# EasyEDA Pro project ProPrj_信达杯COREqwq_2025-12-12.epro

# Schematic Schematic1
Board Name: Board1; Create Date: 2025-10-07; Page Name: P1; Project Name: 信达杯COREqwq; Schematic Name: Schematic1; Update Date: 2025-10-07; Company: 嘉立创EDA; Page Size: A4; Version: V1.0
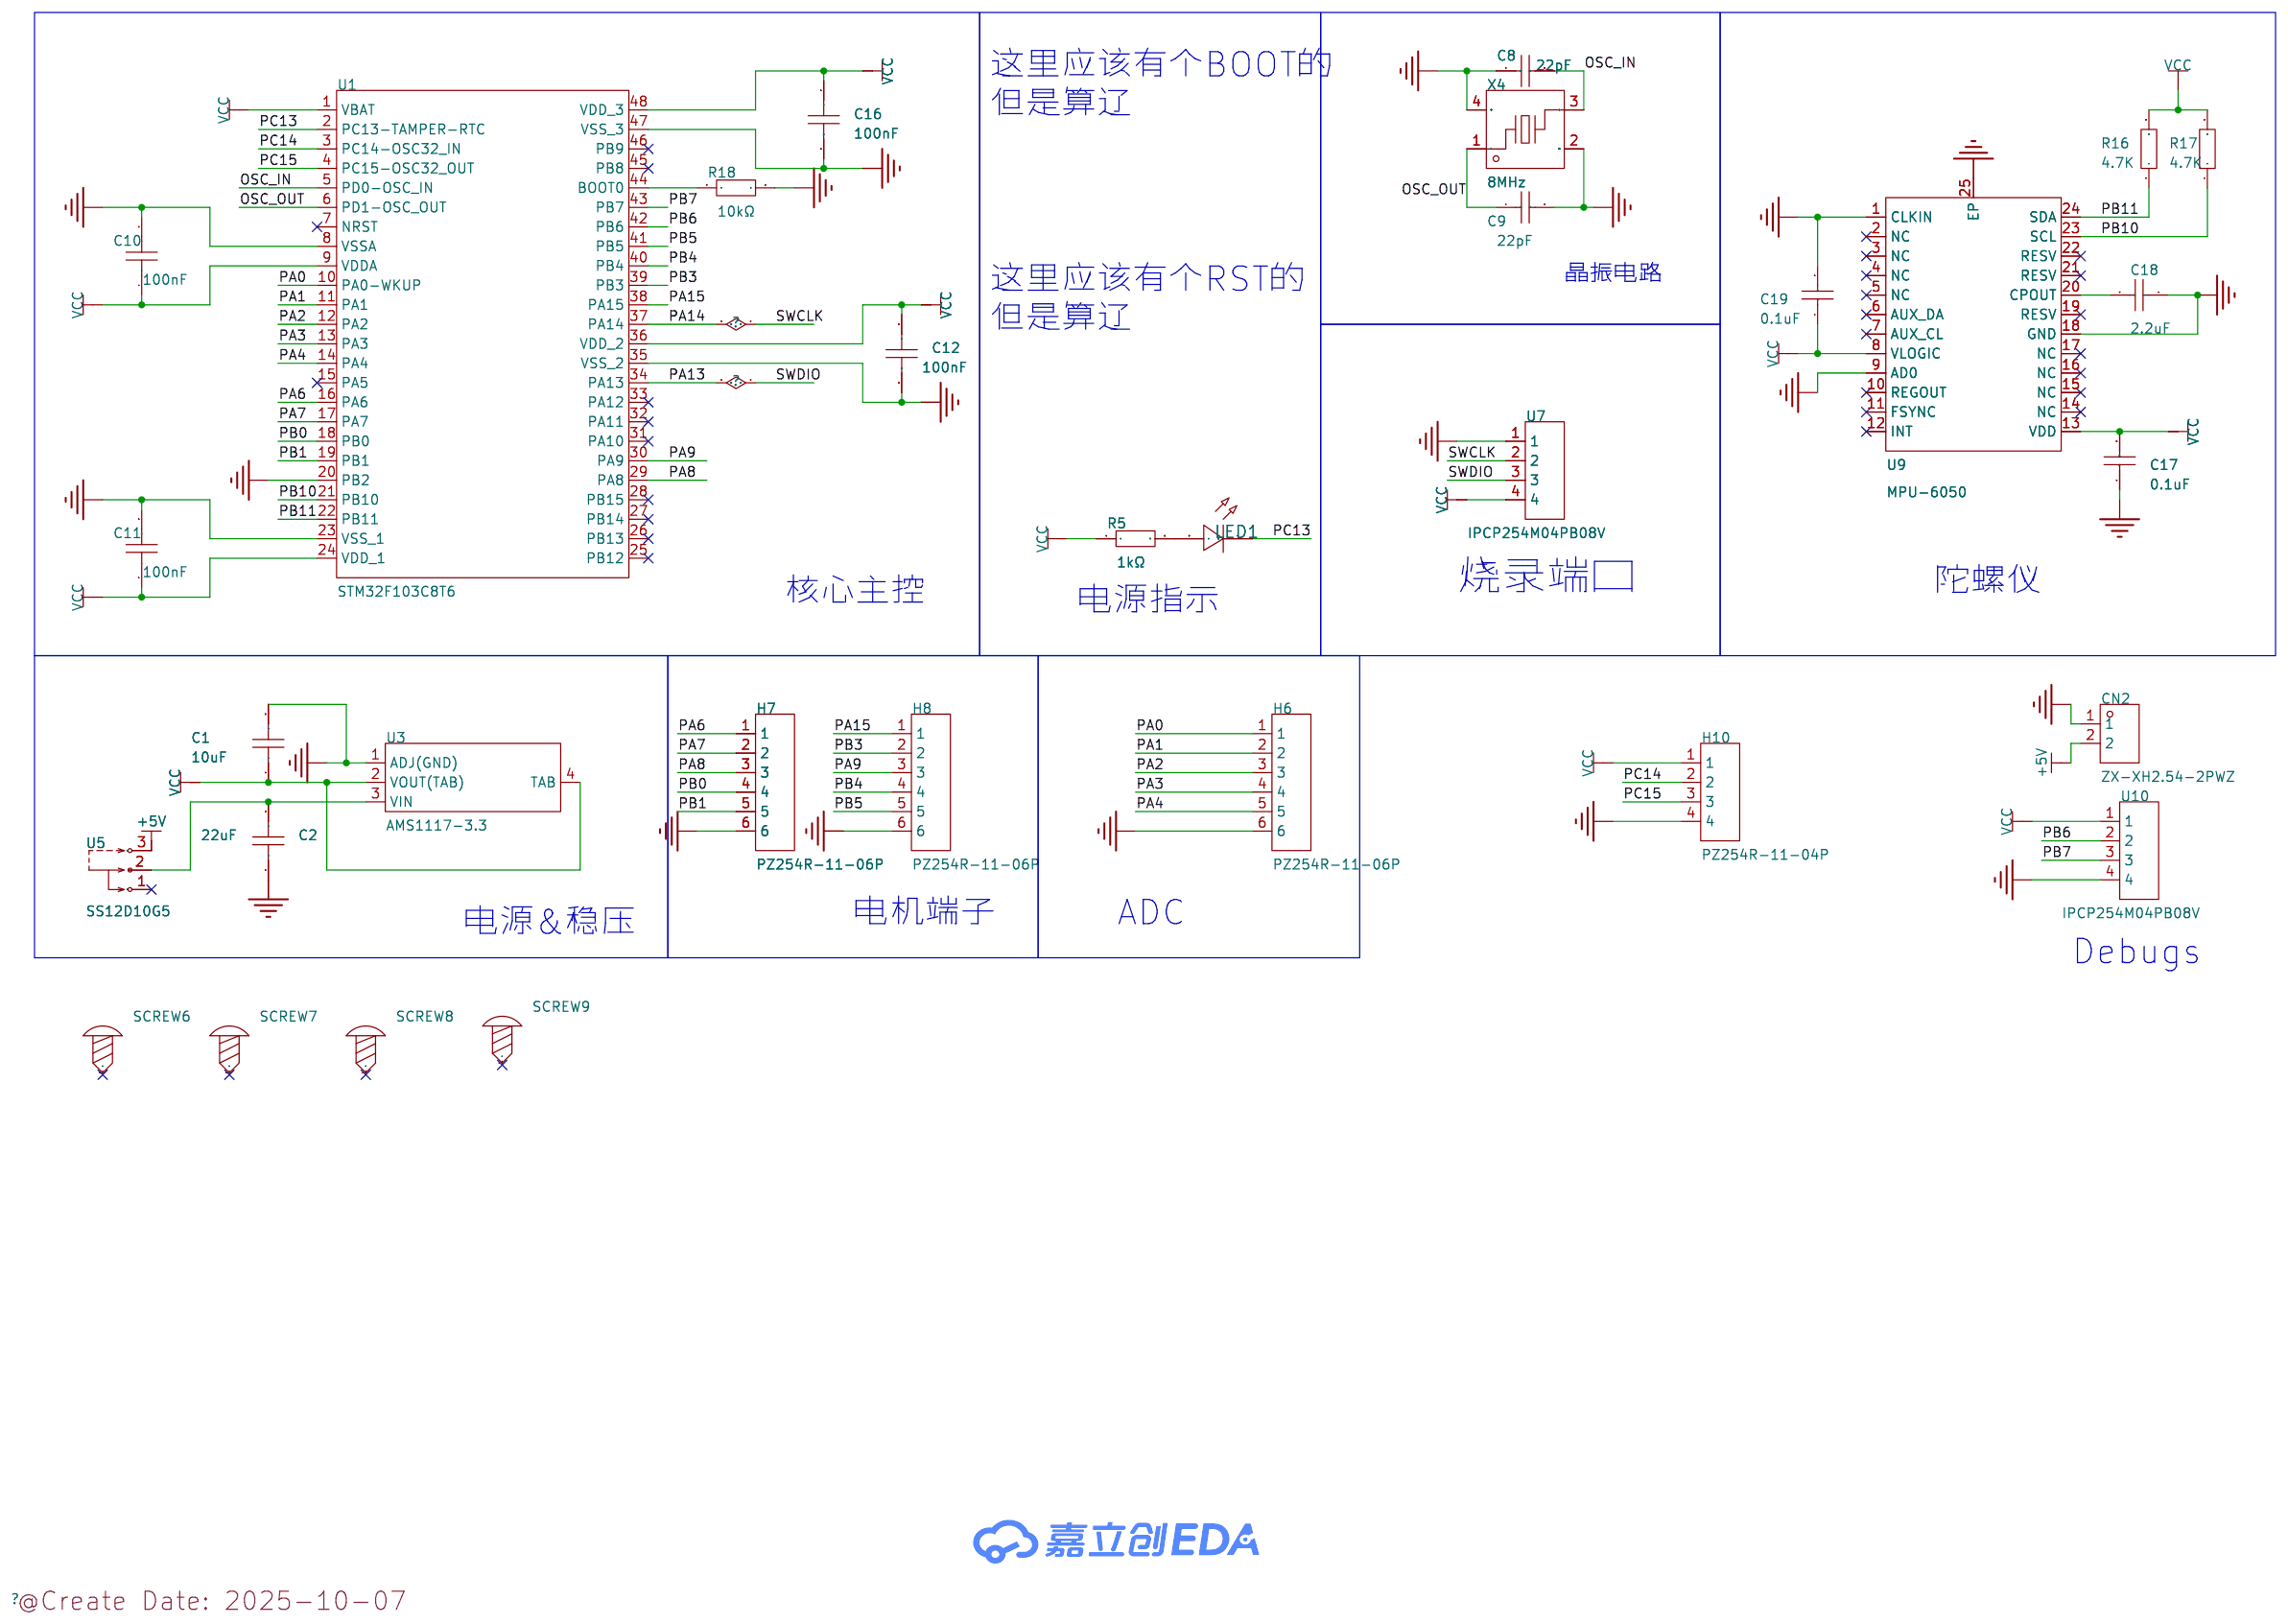
[diagram p0: schematic sheet]

## Parts
C1  10uF  [C0603]
C2  22uF  [C0603]
C8  22pF  [C0603]
C9  22pF  [C0603]
C10  100nF  [C0603]
C11  100nF  [C0603]
C12  100nF  [C0603]
C16  100nF  [C0603]
C17  0.1uF  [C0603]
C18  2.2uF  [C0603]
C19  0.1uF  [C0603]
CN2  ZX-XH2.54-2PWZ  [CONN-TH_2P-P2.50_ZX-XH2.54-2PWZ]
H6  PZ254R-11-06P  [HDR-TH_6P-P2.54-H-M-W10.4]
H7  PZ254R-11-06P  [HDR-TH_6P-P2.54-H-M-W10.4]
H8  PZ254R-11-06P  [HDR-TH_6P-P2.54-H-M-W10.4]
H10  PZ254R-11-04P  [HDR-TH_4P-P2.54-H-M-W10.4]
LED1  -  [LED_0603]
R5  1kΩ  [R0603]
R16  4.7K  [R0603]
R17  4.7K  [R0603]
R18  10kΩ  [R0603]
SCREW6  -  [M2螺丝]
SCREW7  -  [M2螺丝]
SCREW8  -  [M2螺丝]
SCREW9  -  [M2螺丝]
U1  STM32F103C8T6  [LQFP-48_L7.0-W7.0-P0.50-LS9.0-BL]
U3  AMS1117-3.3  [SOT-223-4_L6.5-W3.5-P2.30-LS7.0-BR]
U5  SS12D10G5  [SW-TH_SHOU-HAN_SS12D10G4]
U7  IPCP254M04PB08V  [HDR-TH_4P-P2.54-V-M-1]
U9  MPU-6050  [QFN-24_L4.0-W4.0-P0.50-BL-EP2.7]
U10  IPCP254M04PB08V  [HDR-TH_4P-P2.54-V-M-1]
X4  8MHz  [CRYSTAL-SMD_4P-L3.2-W2.5-BL]

## Library data of the parts
C1 C2 = CAP_0603: Supplier Footprint: 0603
C8 C9 C17-C19 = CC0603JRNPO9BN220: 容值:22pF;精度:±5%;额定电压:50V;材质(温度系数):NP0;; LCSC Part Name: 22pF ±5% 50V; Supplier Part: C105620; Manufacturer: YAGEO(国巨); Supplier Footprint: 0603; JLCPCB Part Class: 扩展库; Datasheet: https://atta.szlcsc.com/upload/public/pdf/source/20170505/1493957838062.pdf; Supplier: LCSC; Tolerance: ±5%; Voltage Rated: 50V; Temperature Coefficient: NP0
C10-C12 C16 = CC0603KRX7R9BB104: 容值:100nF;精度:±10%;额定电压:50V;材质(温度系数):X7R;; LCSC Part Name: 100nF ±10% 50V; Supplier Part: C14663; Manufacturer: YAGEO(国巨); Supplier Footprint: 0603; JLCPCB Part Class: 基础库; Datasheet: https://atta.szlcsc.com/upload/public/pdf/source/20180910/C282072_33301C7F631E79921B82A8DAC6BCC5B3.pdf; Supplier: LCSC; Tolerance: ±10%; Voltage Rated: 50V; Temperature Coefficient: X7R
CN2 = ZX-XH2.54-2PWZ: 插针结构:1x2P;间距:2.5mm;安装方式:弯插;参考系列:XH;总PIN数:2P;排数:1;每排PIN数:2;行距:-;额定电流:3A;触头材质:黄铜;触头镀层:锡;工作温度范围:-25℃~+85℃;; LCSC Part Name: 1x2P 间距:2.5mm 弯插 系列:XH; Supplier Part: C7429641; Manufacturer: Megastar(兆星); Supplier Footprint: 弯插,P=2.5mm; JLCPCB Part Class: 扩展库; Datasheet: https://atta.szlcsc.com/upload/public/pdf/source/20230619/56AE8F2E01CDFEAA97FC89B5ED558AB5.pdf; Supplier: LCSC; Pins Structure: 1x2P; Pitch: 2.5mm; Mounting Type: 弯插; Reference Series: XH; Number of Pins: 2P; Number of Rows: 1; Number of PINs Per Row: 2; Rated Current: 3A; Contact Material: 黄铜; Contact Plating: 锡; Operating Temperature: -25℃~+85℃; Rated Voltage (Max): 250V; Plastic Material: PA66; Flame Retardant Rating: UL94V-0; Color: 白色; Z-Height of the Board: 5.9mm; X-Length of Bottom Edge on Board (Spacing Line): 7.5mm; Y-Width of Bottom Edge on Board: 7.32mm
H6-H8 = PZ254R-11-06P: 插针结构:1x6P;间距:2.54mm;行距:-;圆针/方针:方针;安装方式:弯插;排数:单排;总PIN位数:6P;额定电流:-;额定电压:-;配合针长度:6mm;塑高:2.5mm;触头材质:黄铜;触头镀层:-;工作温度:-40℃~+105℃;颜色:黑色;; LCSC Part Name: 1x6P 间距:2.54mm 方针 弯插; Supplier Part: C492414; Manufacturer: XFCN(兴飞); Supplier Footprint: 弯插,P=2.54mm; JLCPCB Part Class: 扩展库; Datasheet: https://atta.szlcsc.com/upload/public/pdf/source/20200309/C492414_188252315A8FC19F8382BF484DD4F4B8.pdf; Supplier: LCSC; Pin Structure: 1x6P; Pitch: 2.54mm; Circluar Pins/Square Pins: 方针; Mounting Type: 弯插; Number of Rows: 单排; Number of Pins: 6P; Length of Mating Pin: 6mm; Insulation Height: 2.5mm; Contact Material: 黄铜; Operating Temperature: -40℃~+105℃; Color: 黑色
H10 = PZ254R-11-04P: 插针结构:1x4P;间距:2.54mm;行距:-;圆针/方针:方针;安装方式:弯插;排数:单排;总PIN位数:4P;额定电流:-;额定电压:-;配合针长度:6mm;塑高:2.5mm;触头材质:黄铜;触头镀层:-;工作温度:-40℃~+105℃;颜色:黑色;; LCSC Part Name: 1x4P 间距:2.54mm 方针 弯插; Supplier Part: C492412; Manufacturer: XFCN(兴飞); Supplier Footprint: 弯插,P=2.54mm; JLCPCB Part Class: 扩展库; Datasheet: https://item.szlcsc.com/datasheet/PZ254R-11-04P/502968.html; Supplier: LCSC; Pin Structure: 1x4P; Pitch: 2.54mm; Circluar Pins/Square Pins: 方针; Mounting Type: 弯插; Number of Rows: 单排; Number of Pins: 4P; Length of Mating Pin: 6mm; Insulation Height: 2.5mm; Contact Material: 黄铜; Operating Temperature: -40℃~+105℃; Color: 黑色
LED1 = LED_0603-R: Supplier Footprint: 0603
R5 R18 = 0603WAF1002T5E: 电阻类型:厚膜电阻;阻值:10kΩ;精度:±1%;功率:100mW;温度系数:±100ppm/;最大工作电压:75V;工作温度范围:-55~+155;; LCSC Part Name: 10kΩ ±1% 100mW; Supplier Part: C25804; Manufacturer: UNI-ROYAL(厚声); Supplier Footprint: 0603; JLCPCB Part Class: Basic Part; Datasheet: https://atta.szlcsc.com/upload/public/pdf/source/20200306/C422600_1E6D84923E4A46A82E41ADD87F860B5C.pdf; Supplier: LCSC; Type: 厚膜电阻; Tolerance: ±1%; Power(Watts): 100mW; Temperature Coefficient: ±100ppm/; Overload Voltage (Max): 75V; Operating Temperature Range: -55~+155
R16 R17 = Res_0603: Supplier Footprint: 0603
SCREW6-SCREW9 = M2螺丝: Supplier Footprint: 插件
U1 = STM32F103C8T6: CPU内核:ARM-M3;CPU最大主频:72MHz;应用领域:-;; LCSC Part Name: 主流增强型ARM Cortex-M3 MCU，具有64 KB Flash、72 MHz CPU、电机控制、USB和CAN; Supplier Part: C8734; Manufacturer: ST(意法半导体); Supplier Footprint: LQFP-48(7x7); JLCPCB Part Class: 扩展库; Datasheet: https://item.szlcsc.com/datasheet/STM32F103C8T6/9243.html; Supplier: LCSC; CPU Core: ARM-M3; CPU Maximum Speed: 72MHz; Program Storage Size: 64KB; Program Memory Type: FLASH; Number of I/O: 37; ADC (Bit): 12bit; Voltage - Supply: 2V~3.6V
U3 = AMS1117-3.3_C347222: 输出类型:固定;工作电压:12V;输出电压:3.3V;输出电流:1A;电源纹波抑制比(PSRR):60dB@(120Hz);输出极性:正极;; LCSC Part Name: 输出:3.3V 电流:1A 耐压:12V; Supplier Part: C347222; Manufacturer: UMW(友台半导体); Supplier Footprint: SOT-223; JLCPCB Part Class: 扩展库; Datasheet: https://atta.szlcsc.com/upload/public/pdf/source/20241218/BAF0263FA2E44BCD8AF41AA4FA04EFAA.pdf; Supplier: LCSC; Output Type: 固定; Voltage - Supply: 12V; Output Voltage: 3.3V; Output Current: 1A; Power Supply Rejection Ratio (PSRR): 60dB@(120Hz); Voltage Dropout: 1.3V@(1A); Features: 过流保护; Output Configuration: 正极; Number of Outputs: 1
U5 = SS12D10G5: 电路结构:单刀双掷;安装方式:直插;额定电流(DC):2A;额定电压(DC):125V;机械寿命:3千次;; LCSC Part Name: 两档立式插件 3脚拨动开关 柄长5.0mm; Supplier Part: C7431054; Manufacturer: SHOU HAN(首韩); Supplier Footprint: 插件; JLCPCB Part Class: 扩展库; Datasheet: https://atta.szlcsc.com/upload/public/pdf/source/20231130/7A3DB6A149BF0A1DCFFE64FFC07FE434.pdf; Supplier: LCSC; Circuit: 单刀双掷; Switch Length: 12.7mm; Switch Width: 6.7mm; Mounting Style: 直插; Current Rating (DC): 2A; Voltage Rating (DC): 125V; Mechanical Life: 3千次; Operating Temperature: -25℃~+70℃
U7 U10 = IPCP254M04PB08V: 插针结构:1x4P;间距:2.54mm;圆针/方针:方针;安装方式:直插;排数:单排;总PIN位数:4P;额定电流:3A;额定电压:-;塑高:2.5mm;触头材质:黄铜;触头镀层:金;工作温度:-40℃~+105℃;颜色:黑色;; LCSC Part Name: 1x4P 间距:2.54mm 方针 直插; Supplier Part: C22438419; Manufacturer: INCP; Supplier Footprint: 插件,P=2.54mm; JLCPCB Part Class: 扩展库; Datasheet: https://atta.szlcsc.com/upload/public/pdf/source/20240509/C3DB7D997E7C6ED07E93F20304526123.pdf; Supplier: LCSC; Pin Structure: 1x4P; Pitch: 2.54mm; Circluar Pins/Square Pins: 方针; Mounting Type: 直插; Number of Rows: 单排; Number of Pins: 4P; Current Rating: 3A; Insulation Height: 2.5mm; Contact Material: 黄铜; Contact Plating: 金; Operating Temperature: -40℃~+105℃; Color: 黑色
U9 = MPU-6050: 传感器类型:加速度计陀螺仪;; Supplier Part: C24112; Manufacturer: TDK InvenSense(应美盛); Supplier Footprint: QFN-24-EP(4x4); JLCPCB Part Class: 扩展库; Datasheet: https://item.szlcsc.com/datasheet/MPU-6050/24852.html; Supplier: LCSC; Sensor Type: 加速度计陀螺仪; Operating Temperature: -40℃~+85℃
X4 = X32258MSB4SI: 晶振类型:贴片晶振;频率:8MHz;常温频差:±10ppm;负载电容:20pF;频率稳定度:±20ppm;; LCSC Part Name: YSX321SL 8MHZ 4P 3225 20PF ±10PPM -40~85℃ (±20PPM); Supplier Part: C2682774; Manufacturer: YXC(扬兴晶振); Supplier Footprint: SMD3225-4P; JLCPCB Part Class: 扩展库; Datasheet: https://atta.szlcsc.com/upload/public/pdf/source/20240329/19D5F850207469550BEB00D7DFEDBC7A.pdf; Supplier: LCSC; Type: 贴片晶振; Normal temperature Frequency Tolerance: ±10ppm; Load Capacitance: 20pF; Frequency Stability: ±20ppm; Equivalent Series Resistance(ESR): 120Ω; Operating Temperature: -40℃~+85℃

## Nets
+5V: CN2.2 U5.3
GND: C1.2 C2.1 C8.1 C9.2 C10.2 C11.2 C12.2 C16.2 C17.1 C18.1 C19.2 CN2.1 H6.6 H7.6 H8.6 H10.4 R18.2 U1.8(VSSA) U1.20(PB2) U1.23(VSS_1) U1.35(VSS_2) U1.47(VSS_3) U3.1(ADJ(GND)) U7.1 U9.1(CLKIN) U9.9(AD0) U9.18(GND) U9.25(EP) U10.4 X4.2(GND) X4.4(GND)
VCC: C1.1 C10.1 C11.1 C12.1 C16.1 C17.2 C19.1 H10.1 R5.1 R16.2 R17.2 U1.1(VBAT) U1.9(VDDA) U1.24(VDD_1) U1.36(VDD_2) U1.48(VDD_3) U3.2(VOUT(TAB)) U3.4(TAB) U7.4 U9.8(VLOGIC) U9.13(VDD) U10.1
OSC_IN: C8.2 U1.5(PD0-OSC_IN) X4.3
OSC_OUT: C9.1 U1.6(PD1-OSC_OUT) X4.1
PA0: H6.1 U1.10(PA0-WKUP)
PA1: H6.2 U1.11(PA1)
PA2: H6.3 U1.12(PA2)
PA3: H6.4 U1.13(PA3)
PA4: H6.5 U1.14(PA4)
PA6: H7.1 U1.16(PA6)
PA7: H7.2 U1.17(PA7)
PA8: H7.3 U1.29(PA8)
PA9: H8.3 U1.30(PA9)
PA13: U1.34(PA13) U7.3
PA14: U1.37(PA14) U7.2
PA15: H8.1 U1.38(PA15)
PB0: H7.4 U1.18(PB0)
PB1: H7.5 U1.19(PB1)
PB3: H8.2 U1.39(PB3)
PB4: H8.4 U1.40(PB4)
PB5: H8.5 U1.41(PB5)
PB6: U1.42(PB6) U10.2
PB7: U1.43(PB7) U10.3
PB10: R17.1 U1.21(PB10) U9.23(SCL)
PB11: R16.1 U1.22(PB11) U9.24(SDA)
PC13: LED1.1(C) U1.2(PC13-TAMPER-RTC)
PC14: H10.2 U1.3(PC14-OSC32_IN)
PC15: H10.3 U1.4(PC15-OSC32_OUT)
$1N2321: C2.2 U3.3(VIN) U5.2
$1N5548: C18.2 U9.20(CPOUT)
$1N5750: LED1.2(A) R5.2
$1N10485: R18.1 U1.44(BOOT0)

Not connected (* = marked no-connect by the designer): SCREW6 1*; SCREW7 1*; SCREW8 1*; SCREW9 1*; U1 7(NRST)* 15(PA5)* 25(PB12)* 26(PB13)* 27(PB14)* 28(PB15)* 31(PA10)* 32(PA11)* 33(PA12)* 45(PB8)* 46(PB9)*; U5 1*; U9 2(NC)* 3(NC)* 4(NC)* 5(NC)* 6(AUX_DA)* 7(AUX_CL)* 10(REGOUT)* 11(FSYNC)* 12(INT)* 14(NC)* 15(NC)* 16(NC)* 17(NC)* 19(RESV)* 21(RESV)* 22(RESV)*

## Notes on the sheet
- 这里应该有个BOOT的
  但是算辽
- 晶振电路
- 这里应该有个RST的
  但是算辽
- 烧录端口
- 陀螺仪
- 核心主控
- 电源指示
- 电源&稳压
- 电机端子
- ADC
- Debugs

# Board PCB1
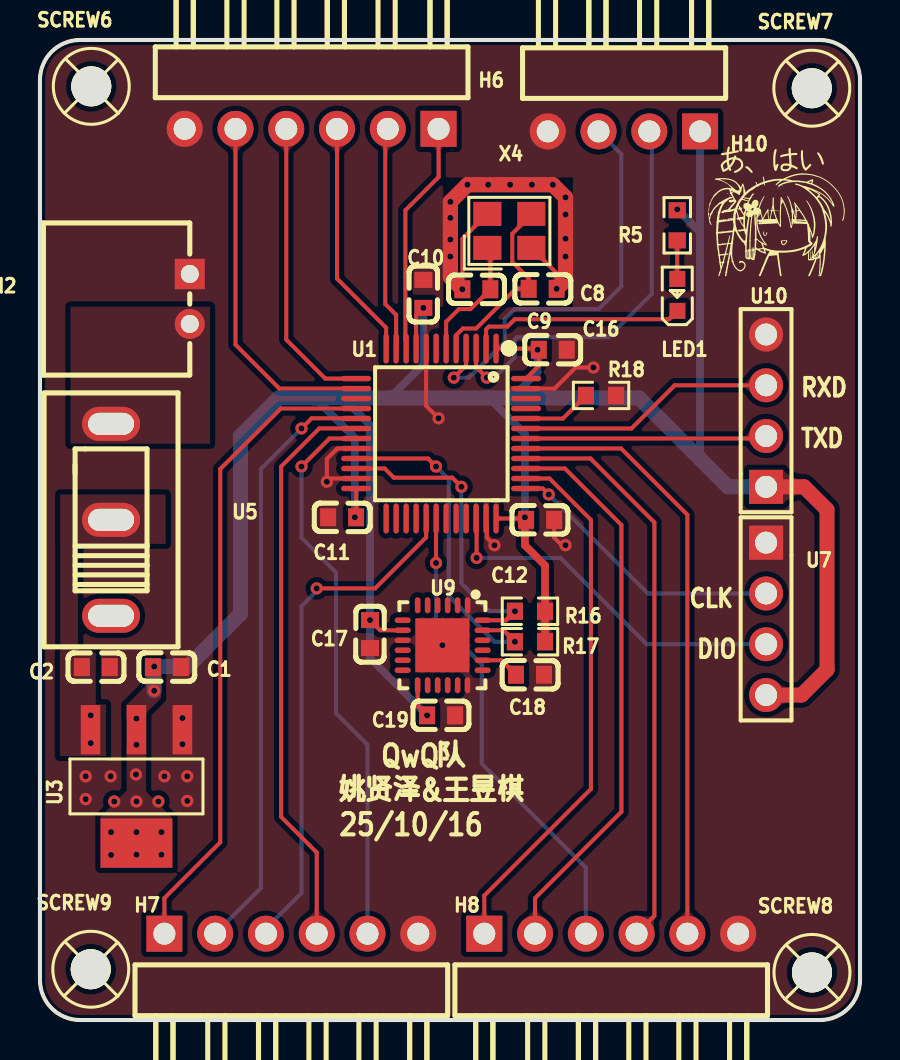
[diagram p1: board, top side]
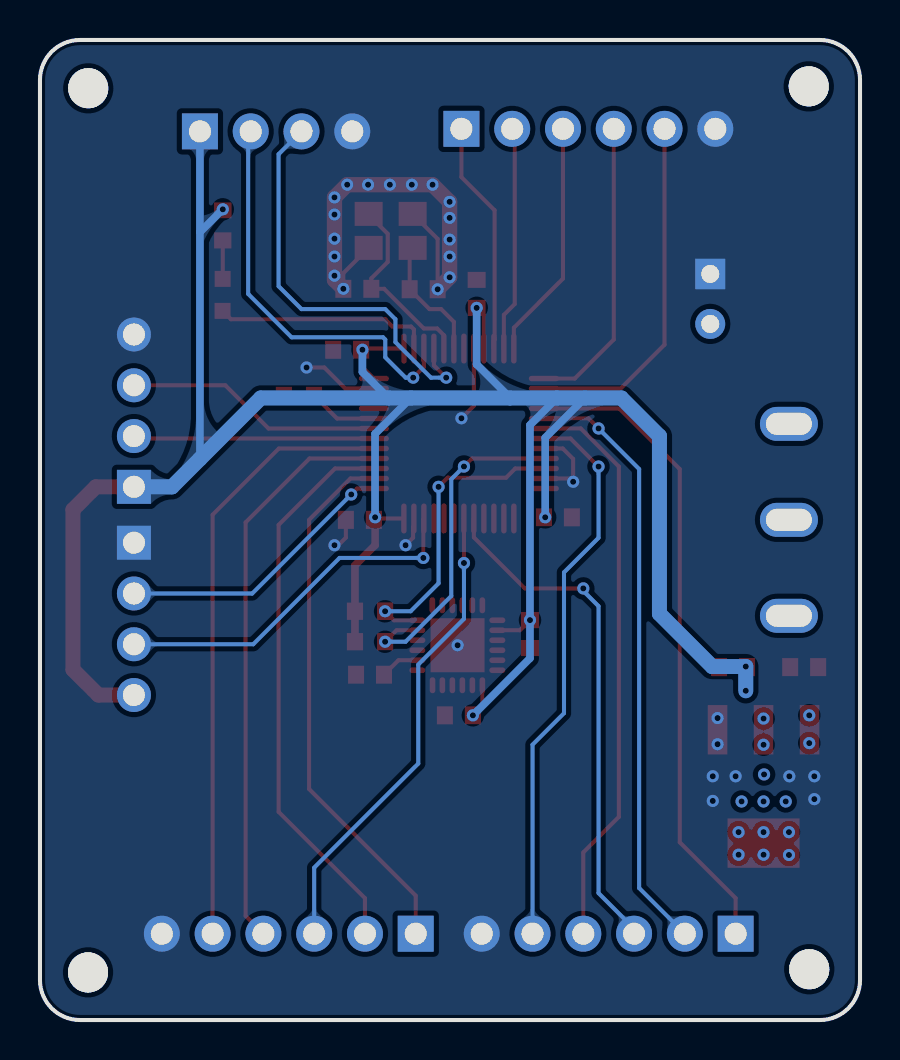
[diagram p2: board, bottom side, seen from below]

Outline 41.02 x 49.02 mm; copper layers: Top Layer, Bottom Layer. Coordinates in mm from the lower left corner of the outline.
Outline path: 0,47.02 0,2 arc(0.59,0.59) 2,0 39.02,0 arc(40.44,0.59) 41.02,2 41.02,47.02 arc(40.44,48.44) 39.02,49.02 2,49.02 arc(0.59,48.44) 0,47.02
Stack: Top Layer 0.035mm / Dielectric1 1.51mm FR4 er 4.5 / Bottom Layer 0.035mm

## Design rules (mm)
template: 自定义配置
spacing copperThickness1oz (default): track to track 0.102, other pairs 0.152 to 0.3
spacing copperThickness2oz: track to track 0.203, other pairs 0.152 to 0.3
track width copperThickness1oz (default): min 0.127, default 0.254, max 2.54
track width copperThickness2oz: min 0.203, default 0.254, max 2.54
differential pair differentialPair (default): width min 0.127, default 0.254, max 2.54; gap min 0.152, default 0.152
via viaSize (default): diameter min 0.5, default 0.61, max 10; hole min 0.3, default 0.305, max 6.3

## Placement (name value [footprint] x y rotation side)
C1  10uF  [C0603]  6.35 17.65 0 top
C2  22uF  [C0603]  2.79 17.65 180 top
C8  22pF  [C0603]  25.15 36.58 180 top
C9  22pF  [C0603]  21.83 36.55 180 top
C10  100nF  [C0603]  19.18 36.32 90 top
C11  100nF  [C0603]  15.11 25.15 180 top
C12  100nF  [C0603]  25.02 25.02 0 top
C16  100nF  [C0603]  25.65 33.53 0 top
C17  0.1uF  [C0603]  16.51 19.3 90 top
C18  2.2uF  [C0603]  24.51 17.27 180 top
C19  0.1uF  [C0603]  20.07 15.24 0 top
CN2  ZX-XH2.54-2PWZ  [CONN-TH_2P-P2.50_ZX-XH2.54-2PWZ]  7.49 36.07 270 top
H6  PZ254R-11-06P  [HDR-TH_6P-P2.54-H-M-W10.4]  13.59 44.58 180 top
H7  PZ254R-11-06P  [HDR-TH_6P-P2.54-H-M-W10.4]  12.57 4.32 0 top
H8  PZ254R-11-06P  [HDR-TH_6P-P2.54-H-M-W10.4]  28.57 4.32 0 top
H10  PZ254R-11-04P  [HDR-TH_4P-P2.54-H-M-W10.4]  29.21 44.45 180 top
LED1  -  [LED_0603]  31.88 36.32 90 top
R5  1kΩ  [R0603]  31.88 39.75 270 top
R16  4.7K  [R0603]  24.51 20.45 0 top
R17  4.7K  [R0603]  24.51 18.92 0 top
R18  10kΩ  [R0603]  28.07 31.24 0 top
SCREW6  -  [M2螺丝]  2.57 46.7 0 top
SCREW7  -  [M2螺丝]  38.61 46.61 0 top
SCREW8  -  [M2螺丝]  38.62 2.38 0 top
SCREW9  -  [M2螺丝]  2.54 2.54 0 top
U1  STM32F103C8T6  [LQFP-48_L7.0-W7.0-P0.50-LS9.0-BL]  20.07 29.34 180 top
U3  AMS1117-3.3  [SOT-223-4_L6.5-W3.5-P2.30-LS7.0-BR]  4.83 11.68 90 top
U5  SS12D10G5  [SW-TH_SHOU-HAN_SS12D10G4]  3.56 25.02 90 top
U7  IPCP254M04PB08V  [HDR-TH_4P-P2.54-V-M-1]  36.32 20.07 270 top
U9  MPU-6050  [QFN-24_L4.0-W4.0-P0.50-BL-EP2.7]  20.14 18.75 180 top
U10  IPCP254M04PB08V  [HDR-TH_4P-P2.54-V-M-1]  36.32 30.48 90 top
X4  8MHz  [CRYSTAL-SMD_4P-L3.2-W2.5-BL]  23.48 39.47 0 top

## Footprints (pads in the part's own frame, mm; a bottom-side part is the same pattern mirrored in y, then rotated)
C0603
  rect 0.8x0.9 smd: 1(-0.7,0) 2(0.7,0)
CONN-TH_2P-P2.50_ZX-XH2.54-2PWZ
  rect 1.524x1.5 hole 0.9: 1(-1.25,0)
  round 1.5 hole 0.9: 2(1.25,0)
CRYSTAL-SMD_4P-L3.2-W2.5-BL
  rect 1.4x1.2 smd: 1(-1.1,-0.85) 2(1.1,-0.85) 3(1.1,0.85) 4(-1.1,0.85)
HDR-TH_4P-P2.54-H-M-W10.4
  rect 1.8x1.8 hole 1.1: 1(-3.81,0)
  round 1.8 hole 1.1: 2(-1.27,0) 3(1.27,0) 4(3.81,0)
HDR-TH_4P-P2.54-V-M-1
  rect 1.7x1.7 hole 1.1: 1(-3.81,0)
  round 1.7 hole 1.1: 2(-1.27,0) 3(1.27,0) 4(3.81,0)
HDR-TH_6P-P2.54-H-M-W10.4
  rect 1.8x1.8 hole 1.1: 1(-6.35,0)
  round 1.8 hole 1.1: 2(-3.81,0) 3(-1.27,0) 4(1.27,0) 5(3.81,0) 6(6.35,0)
LED_0603
  rect 0.8x0.8 smd: 1(-0.851,-0.01) 2(0.75,-0.005)
LQFP-48_L7.0-W7.0-P0.50-LS9.0-BL
  oval 0.27x1.5 smd: 1(-2.75,-4.25) 2(-2.25,-4.25) 3(-1.75,-4.25) 4(-1.25,-4.25) 5(-0.75,-4.25) 6(-0.25,-4.25) 7(0.25,-4.25) 8(0.75,-4.25) 9(1.25,-4.25) 10(1.75,-4.25) 11(2.25,-4.25) 12(2.75,-4.25) 25(2.75,4.25) 26(2.25,4.25) 27(1.75,4.25) 28(1.25,4.25) 29(0.75,4.25) 30(0.25,4.25) 31(-0.25,4.25) 32(-0.75,4.25) 33(-1.25,4.25) 34(-1.75,4.25) 35(-2.25,4.25) 36(-2.75,4.25)
  oval 1.5x0.27 smd: 13(4.25,-2.75) 14(4.25,-2.25) 15(4.25,-1.75) 16(4.25,-1.25) 17(4.25,-0.75) 18(4.25,-0.25) 19(4.25,0.25) 20(4.25,0.75) 21(4.25,1.25) 22(4.25,1.75) 23(4.25,2.25) 24(4.25,2.75) 37(-4.25,2.75) 38(-4.25,2.25) 39(-4.25,1.75) 40(-4.25,1.25) 41(-4.25,0.75) 42(-4.25,0.25) 43(-4.25,-0.25) 44(-4.25,-0.75) 45(-4.25,-1.25) 46(-4.25,-1.75) 47(-4.25,-2.25) 48(-4.25,-2.75)
M2螺丝
  round 2 hole 2: 1(0,0)
QFN-24_L4.0-W4.0-P0.50-BL-EP2.7
  oval 0.28x0.8 smd: 1(-1.25,-2) 2(-0.75,-2) 3(-0.25,-2) 4(0.25,-2) 5(0.75,-2) 6(1.25,-2) 13(1.25,2) 14(0.75,2) 15(0.25,2) 16(-0.25,2) 17(-0.75,2) 18(-1.242,2)
  oval 0.8x0.28 smd: 7(2,-1.25) 8(2,-0.75) 9(2,-0.25) 10(2,0.25) 11(2,0.75) 12(2,1.25) 19(-2,1.25) 20(-2,0.75) 21(-2,0.25) 22(-2,-0.25) 23(-2,-0.75) 24(-2,-1.25)
  rect 2.7x2.7 smd: 25(0.013,0)
R0603
  rect 0.806x0.864 smd: 1(-0.753,0) 2(0.753,0)
SOT-223-4_L6.5-W3.5-P2.30-LS7.0-BR
  rect 2.47x0.98 smd: 1(2.835,-2.3) 2(2.835,0) 3(2.835,2.3)
  rect 2.47x3.6 smd: 4(-2.835,0)
SW-TH_SHOU-HAN_SS12D10G4
  oval 1.7x2.9 hole 1.1x2.3: 1(-4.8,0) 2(0,0) 3(4.8,0)

## Nets
As in the schematic.

Pads without a net: SCREW6 1; SCREW7 1; SCREW8 1; SCREW9 1; U1 7 15 25 26 27 28 31 32 33 45 46; U5 1; U9 2 3 4 5 6 7 10 11 12 14 15 16 17 19 21 22

## Via types
v1: diameter 0.61, hole 0.305, Top Layer to Bottom Layer, 66 vias

## Routing (per net, layer and track width the routed paths; a pad name or vN(x,y) marks a point on that pad's centre or on a via; arc(x,y) is an arc through that point)
GND: length 37.7
  Top Layer w0.203: C12.2 25.72,24.13 26.1,23.75 v1(26.29,23.75) ; U1.20 14.87,28.59 14.35,28.07 v1(14.35,26.92) 14.51,27.09 U1.23 ; v1(25.85,36.58) 25.85,37.36 X4.2 ; X4.4 21.13,39.07 v1(21.13,36.55) ; v1(22.73,23.75) 22.36,24.13 22.36,24.66 22.32,24.7 U1.35 ; U1.47 25.75,31.59 26.8,32.64 v1(27.69,32.64) ; U1.8 19.32,30.72 v1(19.94,30.1)
  Top Layer w0.762: v1(21.13,36.55) v1(20.53,37.15) v1(20.53,40.93) v1(21.38,41.78) v1(25.65,41.78) v1(26.29,41.15) 26.29,37.02 v1(25.85,36.58)
  vias: v1(2.29,12.19) v1(2.29,11.05) v1(3.54,12.19) v1(6.22,12.19) v1(7.13,15.1) v1(7.13,13.8) v1(7.37,12.19) v1(7.37,10.96) v1(20.13,18.75) v1(20.53,40.12) v1(20.53,39.04) v1(20.53,38.19) v1(22.42,41.78) v1(23.52,41.78) v1(24.61,41.78) v1(26.29,40.29) v1(26.29,39.08) v1(26.29,38.19) v1(26.29,37.23)
VCC: length 135.9
  Top Layer w0.203: U1.9 18.82,35.26 v1(19.18,35.62) ; v1(19.37,15.24) 18.89,15.71 U9.13 ; v1(16.51,20) 17.02,19.5 U9.8 ; C11.1 15.82,25.15 U1.24 ; U1.48 24.95,32.72 C16.1 24.9,33.59 U1.1 ; U1.36 24.25,25.09 24.26,25.08
  Top Layer w0.381: v1(24.26,25.15) 24.26,23.75 25.26,22.74 R16.2 R17.2
  Top Layer w0.75: U10.1 38.23,26.67 39.37,25.53 39.37,17.53 38.1,16.26 U7.4
  Bottom Layer w0.381: 13.76,31.11 15.75,29.12 v1(15.75,25.15) ; v1(24.26,25.15) 24.26,29.32 22.46,31.11 ; 17.5,31.11 19.18,32.8 v1(19.18,35.62) ; 23.59,31.11 24.89,32.42 v1(24.89,33.53) ; 33.02,39.41 33.02,28.07 ; 33.02,39.41 v1(31.88,40.55) ; 33.02,39.41 H10.1 ; 15.15,31.11 16.51,29.76 v1(16.51,20) 16.51,18.1 v1(19.37,15.24)
  Bottom Layer w0.75: U10.1 34.42,26.67 29.97,31.11 11.94,31.11 10.03,29.21 10.03,20.32 7.39,17.68 v1(5.72,17.68) v1(5.72,16.47)
  vias: v1(3.56,9.4) v1(3.56,8.25) v1(3.72,10.93) v1(4.83,15.08) v1(4.83,13.77) v1(4.8,12.28) v1(4.83,10.93) v1(4.83,9.4) v1(4.83,8.27) v1(5.92,10.93) v1(6.08,9.4) v1(6.08,8.27)
OSC_IN: length 9.7
  Top Layer w0.203: U1.5 20.82,34.25 21.15,34.59 21.82,34.59 23.81,36.58 C8.2 24.45,37.1 23.63,37.92 23.63,39.33 24.45,40.15 24.45,40.19 X4.3
OSC_OUT: length 6.4
  Top Layer w0.203: X4.1 22.53,38.47 C9.1 21.54,35.56 20.96,35.56 20.32,34.92 U1.6
PA0: length 11.7
  Top Layer w0.203: U1.10 18.32,34 18.28,34.04 18.28,40.5 19.94,42.16 H6.1
PA1: length 11.3
  Top Layer w0.203: H6.2 17.27,44.45 17.27,35.81 17.82,35.27 U1.11
PA2: length 12
  Top Layer w0.203: U1.12 17.32,34.63 14.86,37.08 H6.3
PA3: length 14.8
  Top Layer w0.203: U1.13 14.27,32.09 12.32,34.04 H6.4
PA4: length 17.7
  Top Layer w0.203: U1.14 11.97,31.59 9.78,33.78 H6.5
PA6: length 32.5
  Top Layer w0.203: U1.16 12.04,30.59 9.02,27.56 9.02,8.89 6.22,6.1 H7.1
PA7: length 30
  Top Layer w0.203: U1.17 15.8,30.1 13.59,30.1 v1(13.08,29.59)
  Bottom Layer w0.203: H7.2 11.05,6.6 11.05,27.56 v1(13.08,29.59)
PA8: length 25.8
  Top Layer w0.203: v1(13.84,21.59) 16.76,21.59 19.32,24.14 U1.29
  Bottom Layer w0.203: v1(13.84,21.59) 13.84,21.46 13.08,20.7 13.08,6.35 11.3,4.57 H7.3
PA9: length 23.9
  Top Layer w0.203: v1(19.81,22.86) 19.81,25.08 U1.30
  Bottom Layer w0.203: H8.3 27.31,7.62 22.1,12.83 22.1,17.78 19.81,20.07 v1(19.81,22.86)
PA13: length 18.3
  Top Layer w0.203: v1(21.84,23.11) 21.84,25.06 U1.34
  Bottom Layer w0.203: U7.3 30.35,18.8 26.03,23.11 v1(21.84,23.11)
PA14: length 14.2
  Top Layer w0.203: v1(25.45,26.29) 25.15,26.59 U1.37
  Bottom Layer w0.203: v1(25.45,26.29) 30.4,21.34 U7.2
PA15: length 27
  Top Layer w0.203: H8.1 22.22,6.22 27.56,11.56 27.56,25.02 25.49,27.09 U1.38
PB0: length 28.6
  Top Layer w0.203: H7.4 13.84,8.38 12.06,10.16 12.06,27.69 13.97,29.59 15.81,29.59 U1.18
PB1: length 28.1
  Top Layer w0.203: U1.19 14.48,29.09 v1(13.08,27.69)
  Bottom Layer w0.203: H7.5 16.38,13.77 14.81,15.34 14.81,22.39 13.08,24.12 v1(13.08,27.69)
PB3: length 28.2
  Top Layer w0.203: U1.39 26.26,27.59 29.08,24.76 29.08,10.41 24.76,6.1 H8.2
PB4: length 28.7
  Top Layer w0.203: H8.4 30.73,5.21 30.73,24.89 27.54,28.09 U1.40
PB5: length 30.4
  Top Layer w0.203: U1.41 29.07,28.59 32.38,25.27 H8.5
PB6: length 12.1
  Top Layer w0.203: U10.2 36.2,29.09 U1.42
PB7: length 12.9
  Top Layer w0.203: U10.3 31.75,31.75 29.59,29.59 U1.43
PB10: length 17
  Top Layer w0.203: U9.23 23.19,19.5 v1(23.76,18.92) ; v1(19.81,27.69) 19.41,28.09 U1.21
  Bottom Layer w0.203: v1(19.81,27.69) 20.45,27.05 20.45,21.21 22.73,18.92 v1(23.76,18.92)
PB11: length 15.5
  Top Layer w0.203: v1(23.76,20.45) 23.31,19.99 22.14,19.99 ; U1.22 17.24,27.59 17.7,27.13 20.62,27.13 v1(21.08,26.67)
  Bottom Layer w0.203: v1(21.08,26.67) 21.08,21.84 22.48,20.45 v1(23.76,20.45)
PC13: length 10.9
  Top Layer w0.203: U1.2 22.32,34.54 22.46,34.69 23.38,34.69 23.75,35.05 31.47,35.05 LED1.1
PC14: length 20.4
  Top Layer w0.203: v1(22.35,32.13) 21.82,32.67 U1.3
  Bottom Layer w0.203: v1(22.35,32.13) 22.73,32.13 23.75,33.15 23.75,34.04 23.86,34.15 28.44,34.15 30.61,36.32 30.61,44.32 H10.2
PC15: length 20.9
  Top Layer w0.203: U1.4 21.32,32.75 v1(20.7,32.13)
  Bottom Layer w0.203: v1(20.7,32.13) 21.46,32.13 23.24,33.91 23.24,35.05 23.75,35.56 27.94,35.56 29.08,36.7 29.08,43.31 H10.3
$1N2321:
  vias: v1(2.54,15.24) v1(2.54,13.85)
$1N5548: length 2
  Top Layer w0.203: 22.14,17.99 23.09,17.99 C18.2
$1N5750: length 1.9
  Top Layer w0.203: R5.2 31.88,37.08 LED1.2
$1N10485: length 3.5
  Top Layer w0.203: R18.1 26.16,30.09 U1.44

## Copper pours and planes (outline as drawn; the poured copper is in the pictures)
+5V on Top Layer: 1.52,35.69 8.51,35.69 8.51,28.83 1.52,28.83
GND on Top Layer: -3.33,51.98 44.83,51.98 44.83,-2.16 -3.33,-2.16
GND on Bottom Layer: -1.65,53.47 43.31,53.47 43.31,-2.29 -1.65,-2.29
VCC on Top Layer: 3.02,13.48 6.58,13.48 6.58,9.14 3.02,9.14
VCC on Top Layer: 4.32,17.65 6.05,17.65 6.05,14.86 4.32,14.86
$1N2321 on Top Layer: 1,26.29 6.29,26.29 6.29,13.21 1,13.21

Small or netless copper shapes (teardrops, artwork), in the pictures only: 82 on Top Layer, 37 on Bottom Layer

## Text on the board
Top Silkscreen Layer: CLK | DIO | RXD | TXD | QwQ队 / 姚贤泽&王昱棋 / 25/10/16
